# EAGLE schematic untitled (EAGLE 9.3.1)
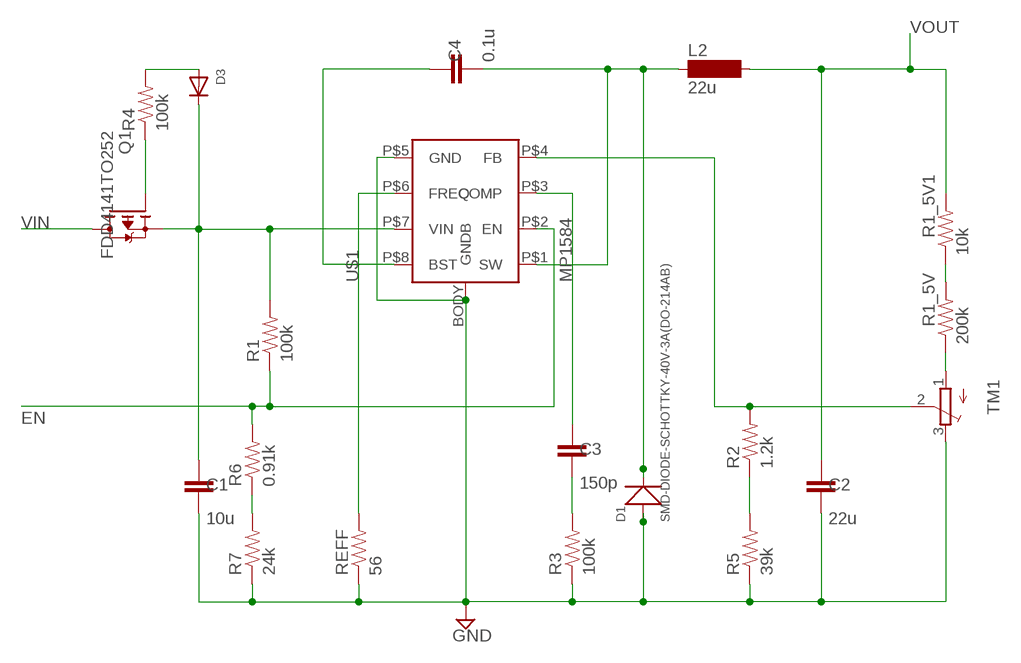
[diagram p0: schematic, sheet 1]

## Parts
C1  10u  CAP0603-CAP  [0603-CAP]
C2  22u  CAP0603-CAP  [0603-CAP]
C3  150p  CAP0603-CAP  [0603-CAP]
C4  0.1u  CAP0603-CAP  [0603-CAP]
D1  SMD-DIODE-SCHOTTKY-40V-3A(DO-214AB)  [DO-214AB]
D3  DIODESOD-523  [SOD-523]
L2  22u  SM-NE45  [SM-NE45]
Q1  FDD4141TO252  [TO252]
R1  100k  RESISTOR0603-RES  [0603-RES]
R1_5V  200k  RESISTOR0603-RES  [0603-RES]
R1_5V1  10k  RESISTOR0603-RES  [0603-RES]
R2  1.2k  RESISTOR0603-RES  [0603-RES]
R3  100k  RESISTOR0603  [0603-RES]
R4  100k  RESISTOR0603-RES  [0603-RES]
R5  39k  RESISTOR0603  [0603-RES]
R6  0.91k  RESISTOR0603  [0603-RES]
R7  24k  RESISTOR0603-RES  [0603-RES]
REFF  56  RESISTOR0603-RES  [0603-RES]
TM1  TRIMPOTTC33X  [TC33X]
U$1  MP1584  [MP]

## Nets
EN: R1.1 R6.2 U$1.P$2(EN)
GND: C1.2 C2.2 D1.1(+) R3.1 R5.1 R7.1 REFF.1 TM1.3(E) U$1.BODY(GNDB) U$1.P$5(GND)
N$1: REFF.2 U$1.P$6(FREQ)
N$2: C4.2 D1.2(-) L2.1 U$1.P$1(SW)
N$3: C4.1 U$1.P$8(BST)
N$4: R1_5V.1 TM1.1(A)
N$5: C3.2 R3.2
N$6: Q1.1(G) R4.1
N$7: R2.1 R5.2
N$8: D3.A R4.2
N$9: R6.1 R7.2
N$10: R1_5V1.1 R1_5V.2
N$11: C3.1 U$1.P$3(COMP)
P$1: C1.1 D3.K(C) Q1.2(S) R1.2 U$1.P$7(VIN)
V5: R2.2 TM1.2(S) U$1.P$4(FB)
VIN: Q1.3(D)
VOUT: C2.1 L2.2 R1_5V1.2

## Library data of the parts
C1-C4 = SparkFun-Capacitors:CAP: Capacitor Standard 0603 ceramic capacitor, and 0.1" leaded capacitor.
D1 = SMD-DIODE-SCHOTTKY-40V-3A_DO-214AB_:SMD-DIODE-SCHOTTKY-40V-3A(DO-214AB): 304020018; AVAILABILITY: Unavailable; DESCRIPTION: Rectifier, Schottky; DO-214AB; 3.0A IF; 0.75V; 40V; 100A IFRM; 10000V/us; 1000pF; MF: Vishay; MP: SS34-E3/57T; PACKAGE: DO-214 Vishay; PRICE: None
D3 = adafruit:DIODE: Diode SMADIODE - SMA Surface Mount Package 20V 1A Schottky Diode Digikey: 641-1014-6-ND DO-1N4148 - Through Hole Small Current Diode SOD-123 20V 1 A (.5mV Vf) Schottky Diode - Digikey: MBRX120TPMSCT-ND SOD-323 10V 570mA (.38mV Vf, 3ns) Schottky Diode - Digikey: ZLLS410CT-ND SOD-523 30V 30mA Schottky Diode (RB751S-40TE61) - Digikey: RB751S-40TE61CT-ND SOT23-R/W - SOT23 Package (R = Solder Paste/Reflow Ovens, W = Hand-Soldering) BAT54Film 40V 300mA - Digikey: 497-7162-1-ND
L2 = inductor-neosid:SM-NE45: INDUCTOR SMD chip inductor; OC_FARNELL: unknown; OC_NEWARK: unknown
Q1 = transistor-fet:FDD4141: P-Channel PowerTrench® MOSFET Source: FDD4141.pdf
R1 R1_5V R1_5V1 R2 R4 R7 REFF = SparkFun-Passives:RESISTOR: Resistor Basic schematic elements and footprints for 0603, 1206, and PTH resistors.
R3 R5 R6 = SparkFun-Resistors:RESISTOR: Resistor Basic schematic elements and footprints for 0603, 1206, and PTH resistors.
TM1 = adafruit:TRIMPOT: SMT trimmer potentiometer part number TC33X http://www.ladyada.net/library/eagle
U$1 = mp1584S:MP1584

## Net classes
0 default: width 0.305 mm, drill 0.508 mm, clearance 0.254 mm